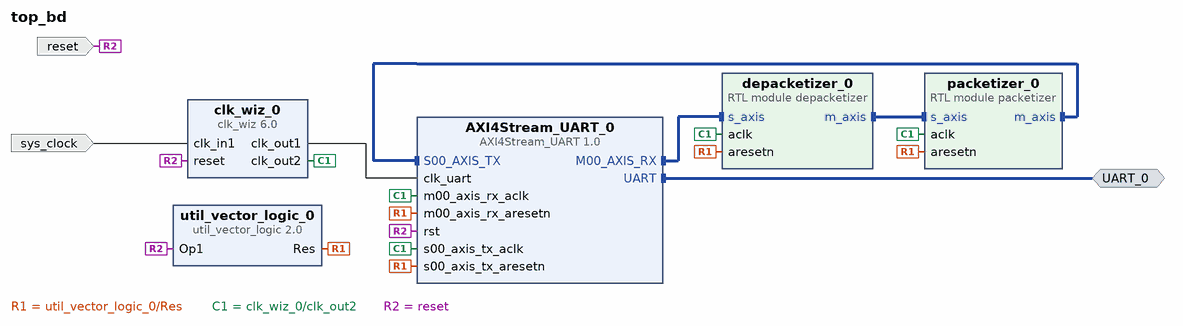
[diagram p0: block diagram of the top level]
# Vivado block design top_bd, xc7a35tcpg236-1, Vivado 2019.2
create_bd_design top_bd

create_bd_intf_port -mode Master -vlnv xilinx.com:interface:uart_rtl:1.0 UART_0
create_bd_port -dir I -type clk sys_clock
set_property -dict {CONFIG.FREQ_HZ 100000000 CONFIG.PHASE 0.000} [get_bd_ports sys_clock]
create_bd_port -dir I -type rst reset
set_property -dict {CONFIG.POLARITY ACTIVE_HIGH} [get_bd_ports reset]

create_bd_cell -type ip -vlnv xilinx.com:ip:clk_wiz:6.0 clk_wiz_0
set_property -dict [list \
  CONFIG.CLKOUT1_JITTER 152.663 \
  CONFIG.CLKOUT1_PHASE_ERROR 132.063 \
  CONFIG.CLKOUT1_REQUESTED_OUT_FREQ 96 \
  CONFIG.CLKOUT2_JITTER 132.221 \
  CONFIG.CLKOUT2_PHASE_ERROR 132.063 \
  CONFIG.CLKOUT2_REQUESTED_OUT_FREQ 200.000 \
  CONFIG.CLKOUT2_USED true \
  CONFIG.CLK_IN1_BOARD_INTERFACE sys_clock \
  CONFIG.MMCM_CLKFBOUT_MULT_F 6.000 \
  CONFIG.MMCM_CLKIN1_PERIOD 10.0 \
  CONFIG.MMCM_CLKIN2_PERIOD 10.0 \
  CONFIG.MMCM_CLKOUT0_DIVIDE_F 6.250 \
  CONFIG.MMCM_CLKOUT1_DIVIDE 3 \
  CONFIG.NUM_OUT_CLKS 2 \
  CONFIG.RESET_BOARD_INTERFACE reset \
  CONFIG.USE_BOARD_FLOW true \
] [get_bd_cells clk_wiz_0]
create_bd_cell -type ip -vlnv xilinx.com:ip:util_vector_logic:2.0 util_vector_logic_0
set_property -dict {CONFIG.C_OPERATION not CONFIG.C_SIZE 1} [get_bd_cells util_vector_logic_0]
create_bd_cell -type module -reference packetizer packetizer_0
create_bd_cell -type module -reference depacketizer depacketizer_0
create_bd_cell -type ip -vlnv TimeEngineers:ip:AXI4Stream_UART:1.0 AXI4Stream_UART_0
set_property -dict {CONFIG.UART_BOARD_INTERFACE usb_uart CONFIG.USE_BOARD_FLOW true} [get_bd_cells AXI4Stream_UART_0]

# ---- connections ----

connect_bd_intf_net [get_bd_intf_pins AXI4Stream_UART_0/M00_AXIS_RX] [get_bd_intf_pins depacketizer_0/s_axis]
connect_bd_intf_net [get_bd_intf_ports UART_0] [get_bd_intf_pins AXI4Stream_UART_0/UART]
connect_bd_intf_net [get_bd_intf_pins packetizer_0/m_axis] [get_bd_intf_pins AXI4Stream_UART_0/S00_AXIS_TX]
connect_bd_intf_net -intf_net depacketizer_0_m_axis [get_bd_intf_pins packetizer_0/s_axis] [get_bd_intf_pins depacketizer_0/m_axis]
connect_bd_net [get_bd_ports sys_clock] [get_bd_pins clk_wiz_0/clk_in1]
connect_bd_net [get_bd_pins util_vector_logic_0/Res] \
  [get_bd_pins packetizer_0/aresetn] [get_bd_pins depacketizer_0/aresetn] [get_bd_pins AXI4Stream_UART_0/s00_axis_tx_aresetn] \
  [get_bd_pins AXI4Stream_UART_0/m00_axis_rx_aresetn]
connect_bd_net [get_bd_pins clk_wiz_0/clk_out2] \
  [get_bd_pins packetizer_0/aclk] [get_bd_pins depacketizer_0/aclk] [get_bd_pins AXI4Stream_UART_0/s00_axis_tx_aclk] \
  [get_bd_pins AXI4Stream_UART_0/m00_axis_rx_aclk]
connect_bd_net [get_bd_ports reset] [get_bd_pins AXI4Stream_UART_0/rst] [get_bd_pins util_vector_logic_0/Op1] [get_bd_pins clk_wiz_0/reset]
connect_bd_net [get_bd_pins clk_wiz_0/clk_out1] [get_bd_pins AXI4Stream_UART_0/clk_uart]
set_property HDL_ATTRIBUTE.DEBUG true [get_bd_intf_nets depacketizer_0_m_axis]
set_property HDL_ATTRIBUTE.MARK_DEBUG true [get_bd_intf_nets depacketizer_0_m_axis]

validate_bd_design
save_bd_design
